# Altium schematic sheet uShake_POWER.SchDoc
size A4
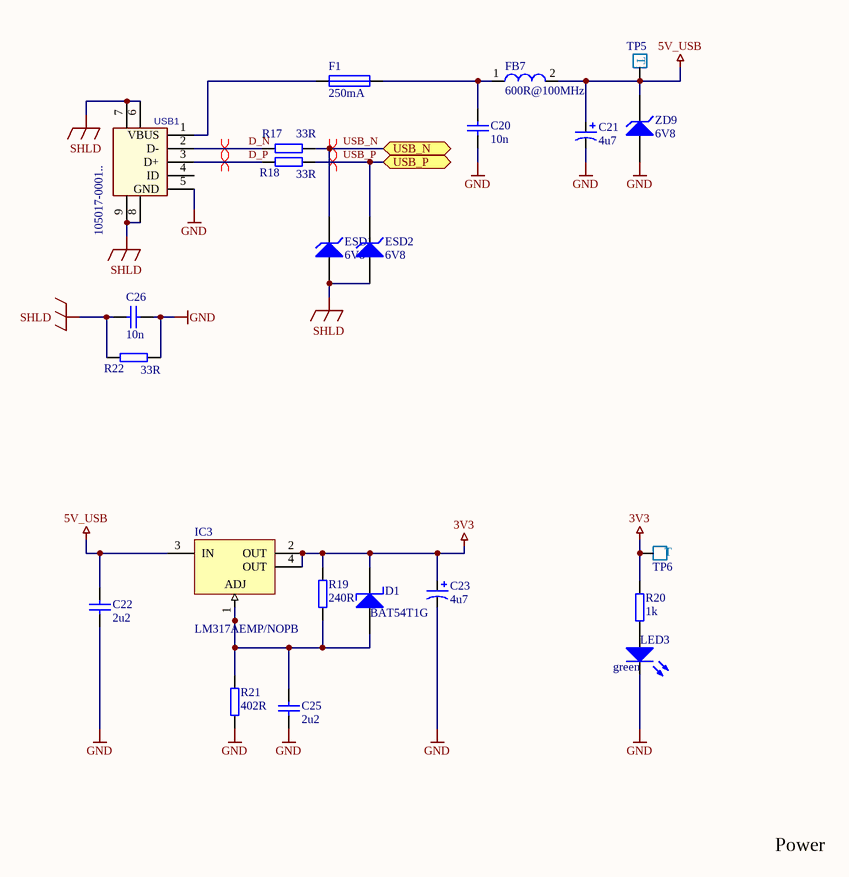
[diagram p0: uShake_POWER.SchDoc]

## Parts
C20  10n  [SMD_C0603]
C21  4u7  [Tantalum 3216]
C22  2u2  [SMD_C0805]
C23  4u7  [Tantalum 3216]
C25  2u2  [SMD_C0805]
C26  10n  [SMD_C0603]
D1  BAT54T1G  [SOD-123]
ESD1  6V8  [SMD_R0603]
ESD2  6V8  [SMD_R0603]
F1  250mA  [PPTCF 1206]
FB7  600R@100MHz  [SMD_R0603]
IC3  LM317AEMP/NOPB  [SOT-223]
LED3  green  [SMD_LD0603]
R17  33R  [SMD_R0603]
R18  33R  [SMD_R0603]
R19  240R  [SMD_R0603]
R20  1k  [SMD_R0603]
R21  402R  [SMD_R0603]
R22  33R  [SMD_R0603]
TP5  TEST_PAD_1.5mm  [TEST_PAD_1.5mm]  (value not drawn)
TP6  TEST_PAD_1.5mm  [TEST_PAD_1.5mm]  (value not drawn)
USB1  105017-0001..  [USB_MICRO_B]
ZD9  6V8  [SOT-23]

## Ports
USB_N (bidir), USB_P (bidir)

## Nets
3V3: C23.1 D1.1(K) IC3.2(OUT) IC3.4(OUT) R19.2 R20.2 TP6.1
5V_USB: C21.1 C22.2 FB7.2 IC3.3(IN) TP5.1 ZD9.3(K)
GND: C20.1 C21.2 C22.1 C23.2 C25.1 C26.1 LED3.1(K) R21.1 R22.1 USB1.5(GND) ZD9.1(A)
SHLD: C26.2 ESD1.1(A) ESD2.1(A) R22.2 USB1.6(GND1) USB1.7(GND2) USB1.8(GND2) USB1.9(GND3)
D_N: R17.2 USB1.2(D-)
D_P: R18.2 USB1.3(D+)
USB_N: ESD1.3(K) R17.1 ; port USB_N
USB_P: ESD2.3(K) R18.1 ; port USB_P
NetC20_2: C20.2 F1.2 FB7.1
NetC25_2: C25.2 D1.2(A) IC3.1(ADJ) R19.1 R21.2
NetF1_1: F1.1 USB1.1(VBUS)
NetLED3_2: LED3.2(A) R20.1

Not connected (* = marked no-connect by the designer): USB1 4(ID)

## Layout directives
differential pair: D_N, D_P, USB_N, USB_P

## Notes on the sheet
- Power
- (in symbol TEST_PAD) T

## Library data of the parts
C20 C22 C25 C26 = CAP: Capacitor; properties: capacitor; farnellCode: *
  C20 C26: value: 10n
  C22 C25: value: 2u2
C21 C23 = Capacitor - polarized: Generic polarized capacitor; Value: 4u7
D1 = DIODE_SCHOTTKY: manufacturer: ON SEMICONDUCTOR; properties: Small Signal Schottky Diode, Single, 30 V, 200 mA, 350 mV, 600 mA, 150 °C; value: BAT54T1G; partnumber: BAT54T1G; farnellCode: 1651157
ESD1 ESD2 = ZenerDiode: ESD Protection device; pin to pad: 3>2; Manufacturer: ON Semiconductor; PartNumber: BZX84C6V8LT1G; Properties: Zener Single Diode, 6.8 V, 225 mW, SOT-23, 6 %, 3 Pins, 150 °C; FarnellCode: 1651587; Value: 6V8
F1 = PolyFuse: Resettable Fuse, PPTC, 1206 (3216 Metric), POLYFUSE 1206L Series, 16 VDC, 250 mA, 500 mA, 0.08 s; Manufacturer: Littelfuse; Manufacturer Number: 2920L030DR; Dealer number: 1596990; Dealer: Farnell; Trip current: 500mA; Max voltage: 16V; Resistance: 2.3Ω; Category: Fuses; Price: 0.46; Type: Poly fuse; Holing current: 250mA; Technology: SMT; HelpURL: https://www.farnell.com/datasheets/683946.pdf
FB7 = FB: Ferrite bead; value: 600R@100MHz
IC3 = LM317KC: 3-Terminal Adjustable Regulator; manufacturer: TEXAS INSTRUMENTS; properties: Linear Voltage Regulator, Adjustable Positive, 40V primary input, 1.2V to 37V/1A/1 Output, SOT-223-4; value: LM317AEMP/NOPB; partnumber: LM317AEMP/NOPB; farnellCode: 3122676
LED3 = LED: value: green
R17-R22 = RESISTOR: properties: resistor; farnellCode: *
  R17 R18 R22: value: 33R
  R19: value: 240R
  R20: value: 1k
  R21: value: 402R
TP5 TP6 = TEST_PAD: value: TEST_PAD_1.5mm
USB1 = Micro_USB_MIUSB-F5M-BB-U: manufacturer: MOLEX; properties: USB Connector, Micro USB Type B, USB 2.0, Receptacle, 5 Ways, Surface Mount, Right Angle; value: 105017-0001..; partnumber: 105017-0001..; farnellCode: 2293836
ZD9 = ZenerDiode: Zener Diode; Manufacturer: ON Semiconductor; PartNumber: BZX84C6V8LT1G; Properties: Zener Single Diode, 6.8 V, 225 mW, SOT-23, 6 %, 3 Pins, 150 °C; FarnellCode: 1651587; Value: 6V8